# EAGLE design mp28164-buck-boost-flashlight-driver-17mm-mk-2.0.1 (EAGLE 9.2.2)
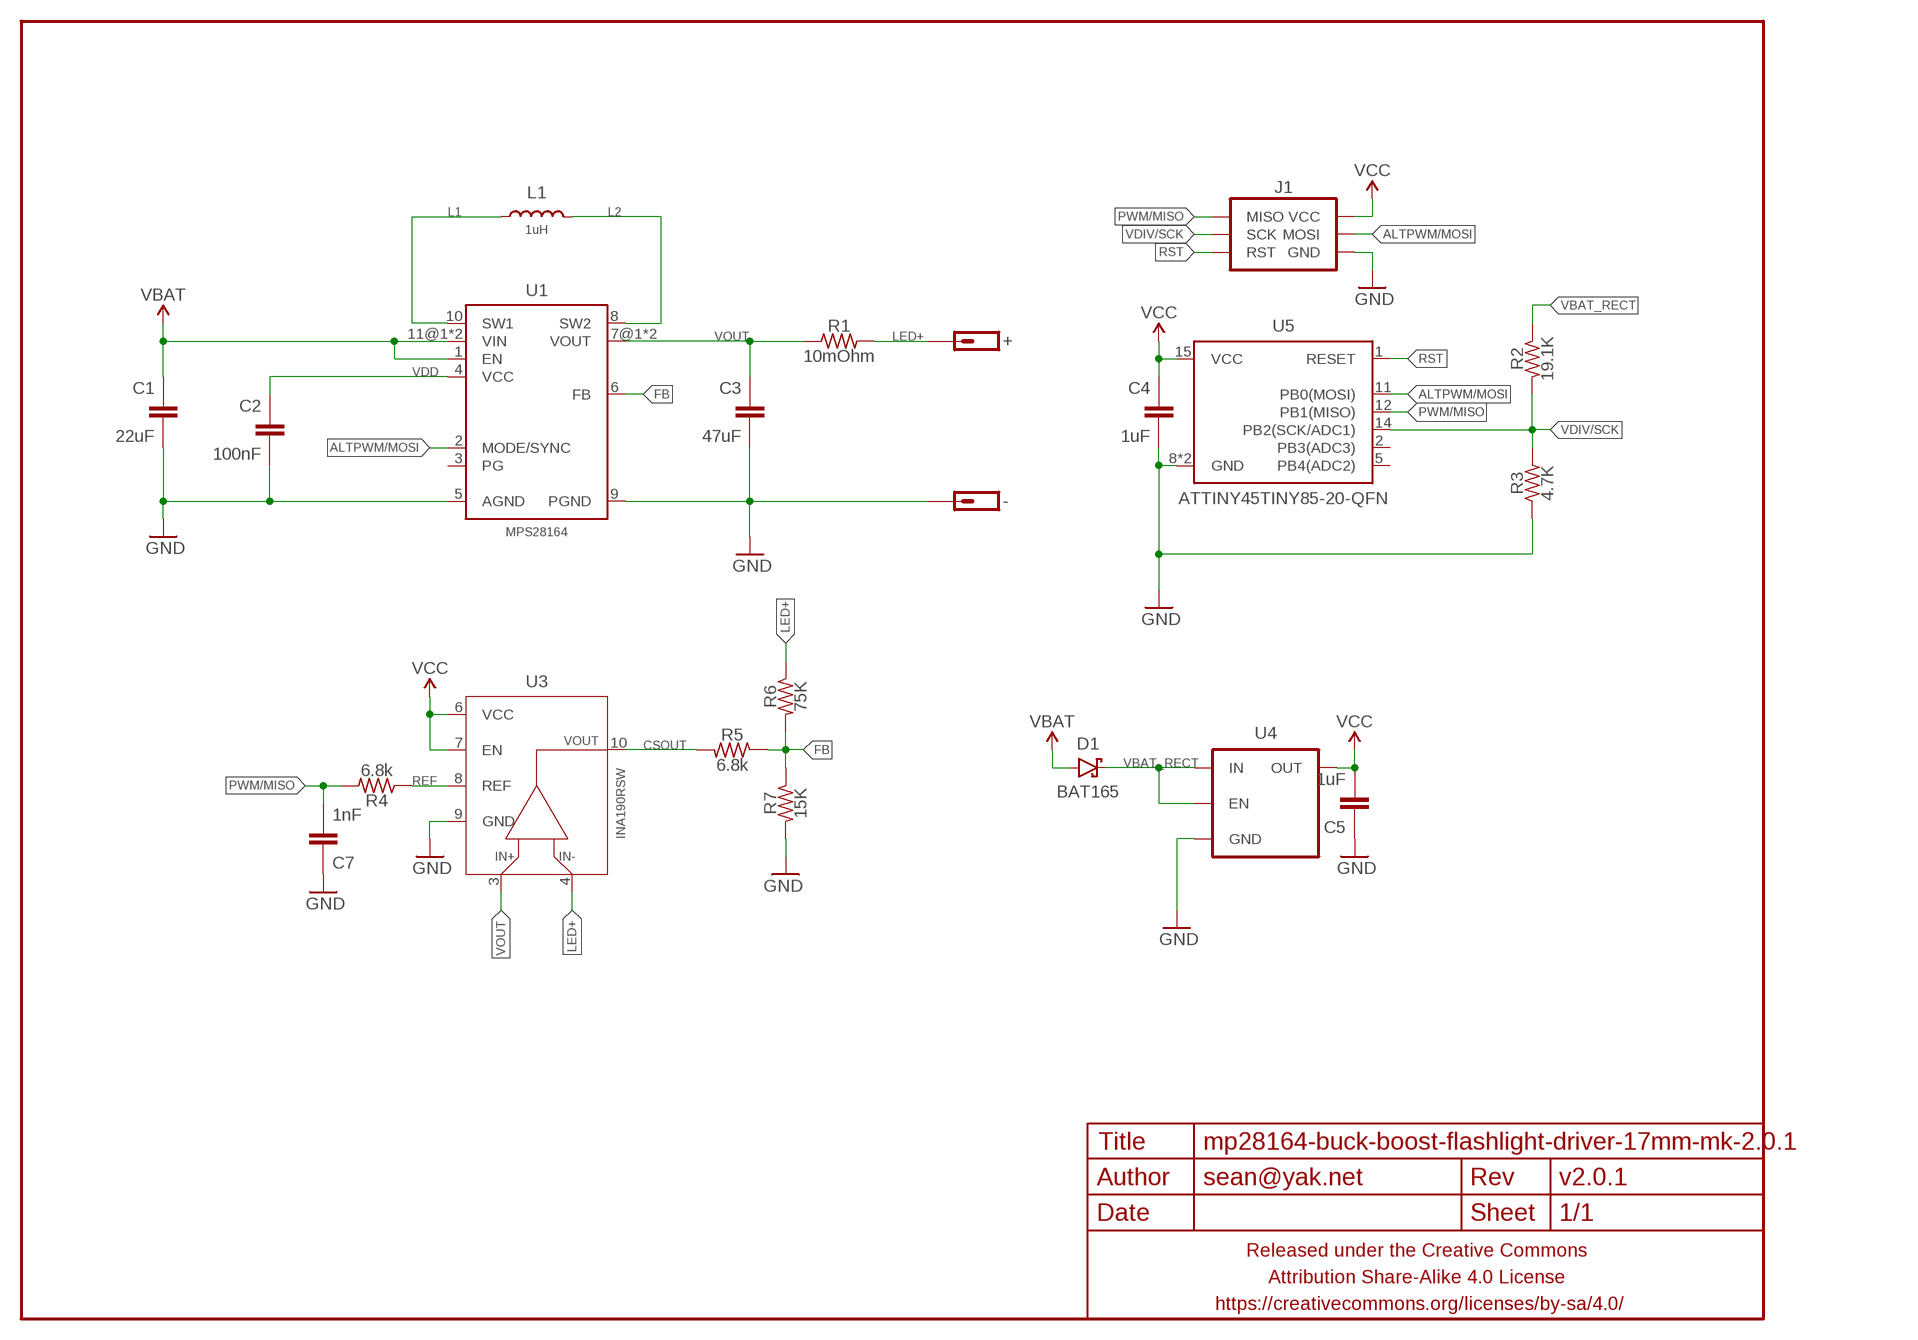
[diagram p0: schematic, sheet 1]

## Parts
+  M01SMD-1.6MMX3.2MM-NS  [1X01-SMD-1.6MMX3.2MM-NS]
-  M01SMD-1.6MMX3.2MM-NS  [1X01-SMD-1.6MMX3.2MM-NS]
C1  22uF  CAPACITOR-CERAMICC1206  [C1206]
C2  100nF  CAPACITOR-CERAMICC0402  [C0402]
C3  47uF  CAPACITOR-CERAMICC1206  [C1206]
C4  1uF  CAPACITOR-CERAMICC0402  [C0402]
C5  1uF  CAPACITOR-CERAMICC0402  [C0402]
C7  1nF  CAPACITOR-CERAMICC0402  [C0402]
D1  BAT165  DIODE-SCHOTTKYSOD323  [SOD323-SCHOTTKY]
FRAME1  FRAME-LETTERNO_PACKAGE  [DUMMY]
J1  AVR_SPI_PRG_6SMD-1.27MM  [2X3-1.27MM-SMD]
L1  1uH  INDUCTORXAL7070  [XAL7070]
R1  10mOhm  RESISTORR1206  [R1206]
R2  19.1K  RESISTORR0402  [R0402]
R3  4.7K  RESISTORR0402  [R0402]
R4  6.8k  RESISTORR0402  [R0402]
R5  6.8k  RESISTORR0402  [R0402]
R6  75K  RESISTORR0402  [R0402]
R7  15K  RESISTORR0402  [R0402]
U1  MPS28164  [MPS28164]
U3  INA190RSW  [UQFN-10]
U4  V_REG_ENTLV700  [SC70]
U5  ATTINY45TINY85-20-QFN  [QFN20]

## Nets
ALTPWM/MOSI: J1.4(MOSI) U1.2(MODE/SYNC) U5.11(PB0(MOSI))
CSOUT: R5.2 U3.10(OUT)
FB: R5.1 R6.2 R7.1 U1.6(FB)
GND: -.P$1 C1.2 C2.2 C3.2 C4.2 C5.1 C7.1 J1.6(GND) R3.1 R7.2 U1.5(AGND) U1.9(PGND) U3.9(GND) U4.2(GND) U5.8(GND) U5.PAD(GND)
L1: L1.P$1 U1.10(SW1)
L2: L1.P$2 U1.8(SW2)
LED+: +.P$1 R1.2 R6.1 U3.4(VIN-)
PWM/MISO: C7.2 J1.1(MISO) R4.2 U5.12(PB1(MISO))
REF: R4.1 U3.8(REF)
RST: J1.5(RST) U5.1(RESET)
VBAT: C1.1 D1.A U1.1(EN) U1.11@1(VIN) U1.11@2(VIN)
VBAT_RECT: D1.C R2.1 U4.1(IN) U4.3(EN)
VCC: C4.1 C5.2 J1.2(VCC) U3.6(VCC) U3.7(EN) U4.5(OUT) U5.15(VCC)
VDD: C2.1 U1.4(VCC)
VDIV/SCK: J1.3(SCK) R2.2 R3.2 U5.14(PB2(SCK/ADC1))
VOUT: C3.1 R1.1 U1.7@1(VOUT) U1.7@2(VOUT) U3.3(VIN+)
Unconnected: U1.3(PG) U5.2(PB3(ADC3)) U5.5(PB4(ADC2))

## Library data of the parts
+ - = a_parts:M01: Header 1 Standard 1-pin 0.1" header. Use with straight break away headers (SKU : PRT-00116), right angle break away headers (PRT-00553), swiss pins (PRT-00743), machine pins (PRT-00117), and female headers (PRT-00115).
C1-C5 C7 = a_parts:CAPACITOR-CERAMIC: CAPACITOR, European symbol
D1 = a_parts:DIODE-SCHOTTKY: Schottky diodes in SFE's production catalog BAT20J 1A 23V 0.62Vf RB751 120mA 40V 0.37Vf PMEG4005EJ 0.5A 40V 0.42Vf MBRA140 1A 40V 0.5Vf B340A 3A 40V SMA
FRAME1 = a_parts:FRAME-LETTER: Schematic Frame Standard 8.5x11 US Letter frame; DESIGNER: sean@yak.net; VERSION: v2.0.1
J1 = a_parts:AVR_SPI_PRG_6: AVR ISP 6 Pin This is the reduced ISP connector for AVR programming. Common on Arduino. This footprint will take up less PCB space and can be used with a 10-pin to 6-pin adapter such as SKU: BOB-08508 **Special note about "TEST_POINT" package. The stop mask is on the top side, so if you want your programming test points to be on the bottom of your board, make sure to place this package on the bottom side of the board. This also ensure that the orientation to program from the bottom side will be correct.
L1 = a_parts:INDUCTOR: Inductors Basic Inductor/Choke - 0603 and 1206. Footprints are not proven and vary greatly between part numbers. SRN6045- 33uH, 20% 1.4A SDR0403-560KL - 56uH, 10%, 500mA RMS/740mA peak
R1-R7 = a_parts:RESISTOR: RESISTOR, American symbol
U1 = a_parts:MPS28164
U3 = a_parts:INA190
U4 = a_parts:V_REG_EN
U5 = a_parts:ATTINY45: Atmel 8-pin 2/4/8kB flash uC

## Board
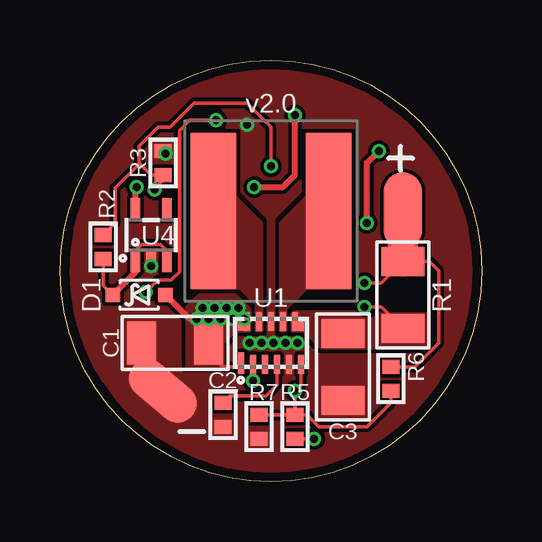
[diagram p1: board, top side]
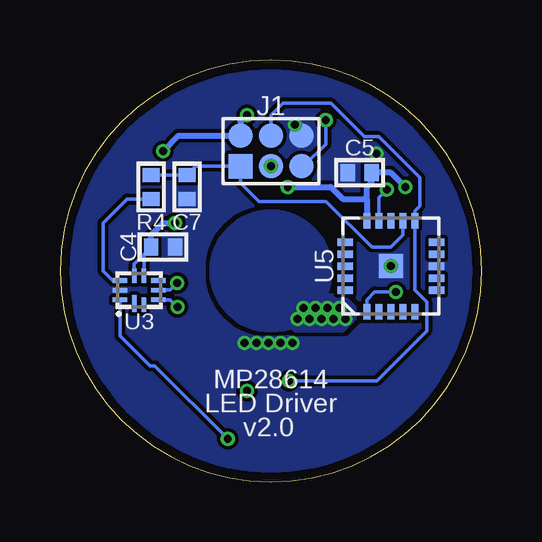
[diagram p2: board, bottom side, seen from below]

Size 17.6 x 17.6 mm. Coordinates in mm from the lower left corner, seen from the top.
Outline: 0,8.8 arc-180 17.6,8.8 arc-180 0,8.8
Copper layers (1*16): Top 0.035559375mm / dielectric 1.6mm / Bottom 0.035559375mm
Design rules "oshpark-2layer": minimum track width 6mil, minimum drill 10mil, track to track 6mil, track to pad 6mil, pad to pad 6mil, via to via 6mil, smd to smd 0mil, copper to edge 15mil, drill to drill 6mil, minimum pad ring 5mil, minimum via ring 5mil, stop-mask expansion 2.5mil, vias tented up to drill 20mil, thermal gap 10mil

### Footprints (pad centres in the part's own frame; a part is rotated, then mirrored left to right if it is on the bottom)
1X01-SMD-1.6MMX3.2MM-NS = smd 1.6 x 3.2: P$1 0,0
C1206 = smd 1.2 x 1.8: 1 -1.4,0; 2 1.4,0
C0402 = smd 0.6 x 0.7: 1 -0.5,0; 2 0.5,0
SOD323-SCHOTTKY = smd 0.6 x 0.6: A -1.1,0; C 1.1,0
2X3-1.27MM-SMD = smd 1.016 x 1.016: 1 -1.27,-0.635; 2 -1.27,0.635; 3 0,-0.635; 4 0,0.635; 5 1.27,-0.635; 6 1.27,0.635
XAL7070 = smd 1.9 x 6.5: P$1 -2.41,0; P$2 2.41,0
R1206 = smd 1.2 x 1.8: 1 -1.4,0; 2 1.4,0
R0402 = smd 0.6 x 0.7: 1 -0.5,0; 2 0.5,0
MPS28164 = smd 0.9 x 0.25: 1 -0.85,1.25 | smd 0.8 x 0.25: 2 -0.9,0.75; 3 -0.9,0.25; 4 -0.9,-0.25; 5 -0.9,-0.75; 6 -0.9,-1.25; 7@1 0.9,-1; 8 0.9,-0.5; 9 0.9,0; 10 0.9,0.5; 11@1 0.9,1 | smd 0.4 x 0.25: 7@2 0.7,-1.25; 11@2 0.71,1.25
UQFN-10 = smd 0.2 x 0.7: 1 -0.2,-0.55 | smd 0.2 x 0.6: 2 0.2,-0.6; 6 0.2,0.6; 7 -0.2,0.6 | smd 0.6 x 0.2: 3 0.8,-0.4; 4 0.8,0; 5 0.8,0.4; 8 -0.8,0.4; 9 -0.8,0; 10 -0.8,-0.4
SC70 = smd 0.4 x 0.9: 1 -0.65,-1.1; 2 0,-1.1; 3 0.65,-1.1; 4 0.65,1.1; 5 -0.65,1.1
QFN20 = smd 0.65 x 0.3: 1 -1.9,1; 2 -1.9,0.5; 3 -1.9,0; 4 -1.9,-0.5; 5 -1.9,-1; 11 1.9,-1; 12 1.9,-0.5; 13 1.9,0; 14 1.9,0.5; 15 1.9,1 | smd 0.3 x 0.65: 6 -1,-1.9; 7 -0.5,-1.9; 8 0,-1.9; 9 0.5,-1.9; 10 1,-1.9; 16 1,1.9; 17 0.5,1.9; 18 0,1.9; 19 -0.5,1.9; 20 -1,1.9 | smd 1 x 1: PAD 0,0

### Placement (x,y rotation side)
+  14.3,11.3 180 top
-  4.3,3.8 230 top
C1  4.8,5.8 180 top
C2  6.8,2.8 270 top
C3  11.8,4.8 270 top
C4  13.3,9.8 0 bottom
C5  5.1,12.9 0 bottom
C7  12.3,12.3 90 bottom
D1  3.3,7.8 180 top
FRAME1  -0.2,-0.2 0 top
J1  8.8,13.8 0 bottom
L1  8.8,11.3 0 top
R1  14.3,7.8 90 top
R2  1.8,9.8 90 top
R3  4.3,13.3 270 top
R4  13.8,12.3 90 bottom
R5  9.8,2.3 270 top
R6  13.8,4.3 270 top
R7  8.3,2.3 270 top
U1  8.8,5.8 90 top
U3  14.3,8 0 bottom
U4  3.8,10.3 0 top
U5  3.8,9 90 bottom

### Tracks (layer width: path | path; a pad name or v marks a point on that pad's centre or on a via)
ALTPWM/MOSI  (via drill 0.33)
  Top 0.152: U1.2 v8.05,4.22
  Bottom 0.152: v8.05,4.22 4.38,4.22 2.3,6.3 2.3,7.5 2.8,8 U5.11 2.8,11.3 2.6,11.5 2.6,12.7 4.3,14.4 4.9,14.4 6.3,15.8 8.3,15.8 8.8,15.3 J1.4 8.8,14.8
CSOUT  (via drill 0.33)
  Top 0.152: R5.2 v10.6,1.8
  Bottom 0.152: v10.6,1.8 13.65,4.85 13.85,4.85 15.1,6.1 U3.10
FB  (via drill 0.33)
  Top 0.152: R7.1 R5.1 | R5.1 v9.8,3.8 10.05,4.05 U1.6 | R6.2 13.8,3.3 12.8,2.3 10.8,2.3 10.3,2.8 R5.1
GND  (via drill 0.33)
  other vias: 8.9,5.8 7.9,5.8 8.4,5.8 9.4,5.8 9.9,5.8 4.4,13.7 7.8,14.9 3.8,9
  pour Bottom (isolate 0.152, rank 6, no thermals): 8.8,0 arc-90 0,8.8 arc-90 8.8,17.6 arc-90 17.6,8.8 arc-90
  pour Top (isolate 0.152, rank 6, no thermals): 8.8,0 arc-90 0,8.8 arc-90 8.8,17.6 arc-90 17.6,8.8 arc-90
L1
  pour Top (rank 4, no thermals): 8.2,6.3 8.2,7.4 7.5,8.1 5.5,8.1 5.5,14.5 7.3,14.5 7.3,11.9 8.4,10.8 8.4,6.3
L2
  pour Top (rank 4, no thermals): 9.4,6.3 9.4,7.2 10.3,8.1 12.1,8.1 12.1,14.5 10.3,14.5 10.3,11.9 9.2,10.8 9.2,6.3
LED+  (via drill 0.33)
  Top 0.152: v12.71,8.3 13.4,8.3 R1.2 15.4,9.2 15.8,8.8 15.8,5.8 14.8,4.8 R6.1
  Top 1.27: R1.2 +.P$1
  Bottom 0.152: v12.71,8.3 13.01,8 U3.4
PWM/MISO
  Bottom 0.152: U5.12 3.3,10.3 3.8,9.8 4.6,9.8 6.5,11.7 9.3,11.7 10.07,12.47 J1.1 11.94,13.17 C7.2 R4.2
REF
  Bottom 0.152: U3.8 15.4,8.4 15.8,8.8 15.8,10.8 14.8,11.8 R4.1
RST  (via drill 0.33)
  Top 0.152: v6.52,15.08 5.42,15.08 4.98,14.65 4.98,8.76 4.64,8.42 4.1,8.42 3.6,7.93 v3.58,7.93
  Bottom 0.152: v6.52,15.08 6.52,14.08 7.43,13.17 J1.5 | U5.1 4.8,7.6 4.47,7.93 v3.58,7.93
VBAT  (via drill 0.33)
  Top 0.152: U1.1 7.4,4.8 6.8,4.8 6.2,5.4 C1.1
  Top 0.25: D1.A 5.4,6.8 v5.7,6.8
  other vias: 7.7,6.8 7.2,6.8 6.7,6.8 5.95,7.25 6.2,6.8 6.45,7.25 6.95,7.25 7.45,7.25
  pour Bottom (isolate 0.152, no thermals): 6.3,8.8 arc-180 11.3,8.8 arc-180
  pour Top (rank 5, no thermals): 7.3,6.3 7.9,6.3 7.9,7.3 7.4,7.8 5.8,7.8 5.3,7.3 5.3,4.8 6.8,4.8 6.8,5.8
  pour Bottom (rank 5, no thermals): 5.3,6.8 5.3,7.3 5.8,7.8 7.8,7.8 8.3,7.3 8.3,6.8 7.8,6.3 5.8,6.3
VBAT_RECT
  Top 0.152: U4.3 4.45,9.65 4.2,9.9 3.4,9.9 3.15,9.65 U4.1 | R2.1 1.8,8.2 D1.C
  Top 0.25: D1.C 3.15,8.75 U4.1
VCC  (via drill 0.33)
  Top 0.25: U4.5 3.15,12.3 v3.2,12.3 | v8.1,12.3 9.3,12.3 9.8,12.8 v9.8,15.3 | v12.8,10.8 12.8,13.3 v13.3,13.8
  Bottom 0.152: C4.1 14.1,9.5 | 14.1,9.5 U3.6 | U3.7 14.5,9.1 14.1,9.5
  Bottom 0.25: v3.2,12.3 3.8,12.9 C5.2 4.6,12.5 4.8,12.3 4.8,11.8 | v9.8,15.3 10.07,15.03 J1.2 12.67,14.44 v13.3,13.8 | C4.1 13.8,10.3 13.3,10.8 v12.8,10.8 | 4.8,11.8 U5.15 | 4.8,11.8 5.8,11.8 6.3,12.3 v8.1,12.3
VDD
  Top 0.152: C2.1 7.1,3.6 8.6,3.6 9.05,4.05 U1.4
VDIV/SCK  (via drill 0.33)
  Top 0.152: v3.96,12.2 3.96,12.26 4.3,12.6 R3.2 3.8,12.8 3.3,13.3 | R2.2 2.3,10.8 2.3,12.27 3.3,13.27 3.3,13.3 | J1.3 8.8,14.8 7.8,15.8 5.6,15.8 4.6,14.8 4.1,14.8 3.3,14 3.3,13.3
  Bottom 0.152: U5.14 4.3,11.86 v3.96,12.2
  other vias: 8.8,13.17
VOUT  (via drill 0.33)
  Top 0.152: R1.1 13.4,7.3 v12.7,7.3
  Bottom 0.152: v12.7,7.3 13,7.6 U3.3
  pour Top (rank 5, no thermals): 9.7,7.1 9.7,6.3 10.2,6.3 10.9,5.6 15.3,5.6 15.3,7 13.3,7 13.1,6.8 12.6,6.8 12.3,7.1

### Text on the board
bPlace: LED Driver | MP28614